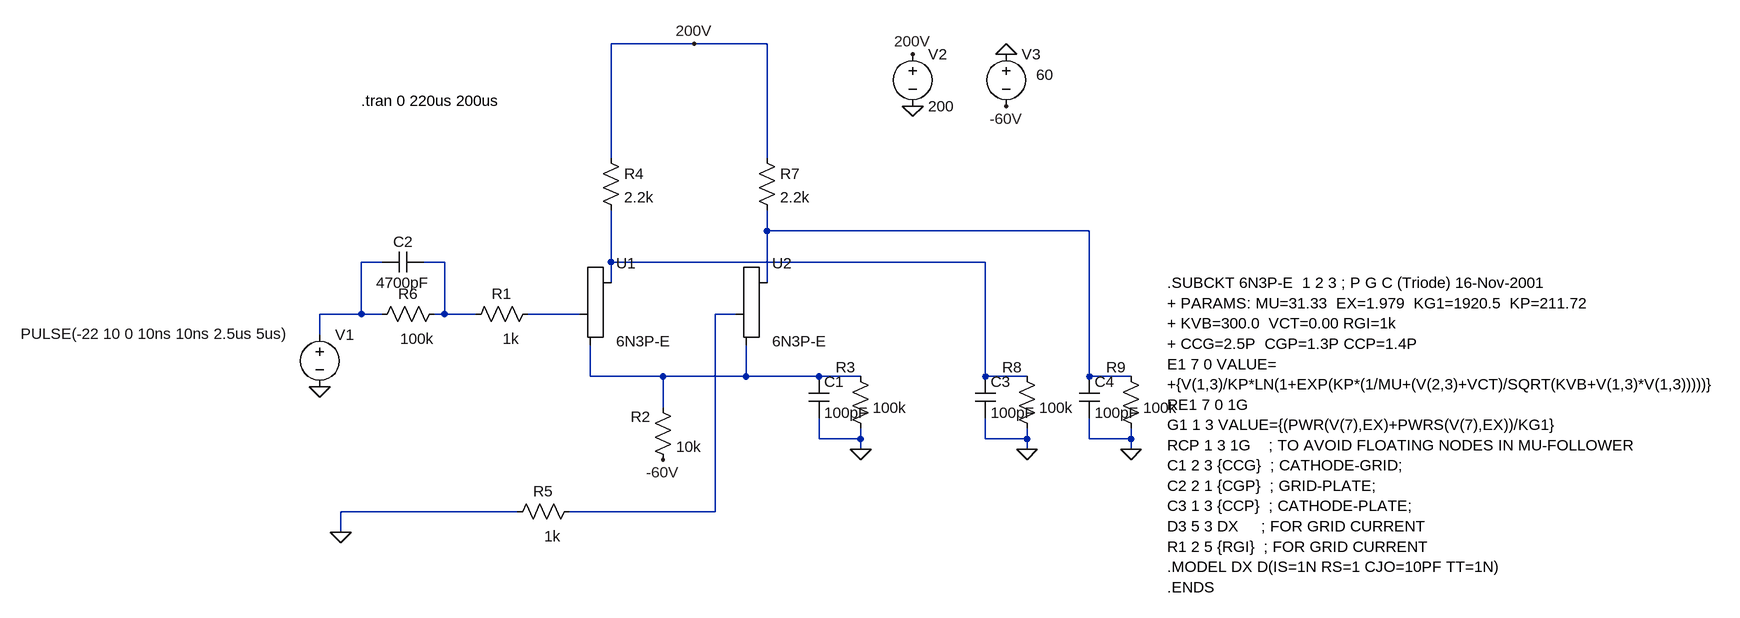
[diagram p0: schematic long-tailed_pair_current_mirror.asc]
long-tailed_pair_current_mirror.asc, the LTspice schematic file:
Version 4
SHEET 1 2516 760
WIRE 304 -240 176 -240
WIRE 416 -240 304 -240
WIRE 176 -64 176 -240
WIRE 416 -64 416 -240
WIRE 416 48 416 16
WIRE 912 48 416 48
WIRE -176 96 -208 96
WIRE -80 96 -112 96
WIRE 176 96 176 16
WIRE 752 96 176 96
WIRE 176 128 176 96
WIRE 416 128 416 48
WIRE -208 176 -208 96
WIRE -208 176 -272 176
WIRE -176 176 -208 176
WIRE -80 176 -80 96
WIRE -80 176 -96 176
WIRE -32 176 -80 176
WIRE 128 176 48 176
WIRE 368 176 336 176
WIRE -272 208 -272 176
WIRE 144 272 144 224
WIRE 256 272 144 272
WIRE 384 272 384 224
WIRE 384 272 256 272
WIRE 496 272 384 272
WIRE 560 272 496 272
WIRE 752 272 752 96
WIRE 816 272 752 272
WIRE 912 272 912 48
WIRE 976 272 912 272
WIRE 256 320 256 272
WIRE 496 368 496 336
WIRE 560 368 560 352
WIRE 560 368 496 368
WIRE 752 368 752 336
WIRE 816 368 816 352
WIRE 816 368 752 368
WIRE 912 368 912 336
WIRE 976 368 976 352
WIRE 976 368 912 368
WIRE 560 384 560 368
WIRE 816 384 816 368
WIRE 976 384 976 368
WIRE 32 480 -240 480
WIRE 336 480 336 176
WIRE 336 480 112 480
WIRE -240 512 -240 480
FLAG -272 288 0
FLAG 640 -144 0
FLAG 560 384 0
FLAG 784 -224 0
FLAG 784 -144 -60V
FLAG 640 -224 200V
FLAG -240 512 0
FLAG 256 400 -60V
FLAG 816 384 0
FLAG 304 -240 200V
FLAG 976 384 0
SYMBOL Misc\\triode 176 176 R0
SYMATTR InstName U1
SYMATTR Value 6N3P-E
SYMBOL voltage -272 192 R0
WINDOW 3 -460 14 Left 2
WINDOW 123 0 0 Left 0
WINDOW 39 -177 50 Left 2
SYMATTR Value PULSE(-22 10 0 10ns 10ns 2.5us 5us)
SYMATTR InstName V1
SYMBOL voltage 640 -240 R0
WINDOW 123 0 0 Left 0
WINDOW 39 0 0 Left 0
SYMATTR InstName V2
SYMATTR Value 200
SYMBOL res 240 304 R0
WINDOW 0 -34 30 Left 2
SYMATTR InstName R2
SYMATTR Value 10k
SYMBOL res 544 256 R0
WINDOW 0 -22 2 Left 2
WINDOW 3 35 64 Left 2
SYMATTR InstName R3
SYMATTR Value 100k
SYMBOL voltage 784 -240 R0
WINDOW 3 46 48 Left 2
WINDOW 123 0 0 Left 0
WINDOW 39 0 0 Left 0
SYMATTR Value 60
SYMATTR InstName V3
SYMBOL Misc\\triode 416 176 R0
SYMATTR InstName U2
SYMATTR Value 6N3P-E
SYMBOL res -80 160 R90
WINDOW 0 0 56 VBottom 2
WINDOW 3 38 42 VTop 2
SYMATTR InstName R6
SYMATTR Value 100k
SYMBOL cap -112 80 R90
WINDOW 0 0 32 VBottom 2
WINDOW 3 32 32 VTop 2
SYMATTR InstName C2
SYMATTR Value 4700pF
SYMBOL res 128 464 R90
WINDOW 0 0 56 VBottom 2
WINDOW 3 38 42 VTop 2
SYMATTR InstName R5
SYMATTR Value 1k
SYMBOL cap 480 272 R0
SYMATTR InstName C1
SYMATTR Value 100pF
SYMBOL res 800 256 R0
WINDOW 0 -22 2 Left 2
WINDOW 3 35 64 Left 2
SYMATTR InstName R8
SYMATTR Value 100k
SYMBOL cap 736 272 R0
SYMATTR InstName C3
SYMATTR Value 100pF
SYMBOL res 400 -80 R0
SYMATTR InstName R7
SYMATTR Value 2.2k
SYMBOL res 64 160 R90
WINDOW 0 0 56 VBottom 2
WINDOW 3 38 42 VTop 2
SYMATTR InstName R1
SYMATTR Value 1k
SYMBOL res 960 256 R0
WINDOW 0 -22 2 Left 2
WINDOW 3 35 64 Left 2
SYMATTR InstName R9
SYMATTR Value 100k
SYMBOL cap 896 272 R0
SYMATTR InstName C4
SYMATTR Value 100pF
SYMBOL res 160 -80 R0
SYMATTR InstName R4
SYMATTR Value 2.2k
TEXT 1032 128 Left 2 !.SUBCKT 6N3P-E  1 2 3 ; P G C (Triode) 16-Nov-2001\n+ PARAMS: MU=31.33  EX=1.979  KG1=1920.5  KP=211.72 \n+ KVB=300.0  VCT=0.00 RGI=1k\n+ CCG=2.5P  CGP=1.3P CCP=1.4P\nE1 7 0 VALUE=\n+{V(1,3)/KP*LN(1+EXP(KP*(1/MU+(V(2,3)+VCT)/SQRT(KVB+V(1,3)*V(1,3)))))}\nRE1 7 0 1G\nG1 1 3 VALUE={(PWR(V(7),EX)+PWRS(V(7),EX))/KG1}\nRCP 1 3 1G    ; TO AVOID FLOATING NODES IN MU-FOLLOWER\nC1 2 3 {CCG}  ; CATHODE-GRID; \nC2 2 1 {CGP}  ; GRID-PLATE; \nC3 1 3 {CCP}  ; CATHODE-PLATE; \nD3 5 3 DX     ; FOR GRID CURRENT\nR1 2 5 {RGI}  ; FOR GRID CURRENT\n.MODEL DX D(IS=1N RS=1 CJO=10PF TT=1N)\n.ENDS
TEXT -208 -152 Left 2 !.tran 0 220us 200us

The netlist it stands for:
* long-tailed_pair_current_mirror.asc
XU1 N004 N005 N007 6N3P-E
V1 N002 0 PULSE(-22 10 0 10ns 10ns 2.5us 5us)
V2 200V 0 200
R2 N007 -60V 10k
R3 N007 0 100k
V3 0 -60V 60
XU2 N001 N006 N007 6N3P-E
R6 N003 N002 100k
C2 N003 N002 4700pF
R5 N006 0 1k
C1 N007 0 100pF
R8 N004 0 100k
C3 N004 0 100pF
R7 200V N001 2.2k
R1 N005 N003 1k
R9 N001 0 100k
C4 N001 0 100pF
R4 200V N004 2.2k
.SUBCKT 6N3P-E  1 2 3 ; P G C (Triode) 16-Nov-2001
+ PARAMS: MU=31.33  EX=1.979  KG1=1920.5  KP=211.72
+ KVB=300.0  VCT=0.00 RGI=1k
+ CCG=2.5P  CGP=1.3P CCP=1.4P
E1 7 0 VALUE=
+{V(1,3)/KP*LN(1+EXP(KP*(1/MU+(V(2,3)+VCT)/SQRT(KVB+V(1,3)*V(1,3)))))}
RE1 7 0 1G
G1 1 3 VALUE={(PWR(V(7),EX)+PWRS(V(7),EX))/KG1}
RCP 1 3 1G    ; TO AVOID FLOATING NODES IN MU-FOLLOWER
C1 2 3 {CCG}  ; CATHODE-GRID;
C2 2 1 {CGP}  ; GRID-PLATE;
C3 1 3 {CCP}  ; CATHODE-PLATE;
D3 5 3 DX     ; FOR GRID CURRENT
R1 2 5 {RGI}  ; FOR GRID CURRENT
.MODEL DX D(IS=1N RS=1 CJO=10PF TT=1N)
.ENDS
.tran 0 220us 200us
.backanno
.end